# EAGLE schematic IrBB (EAGLE 6.3)
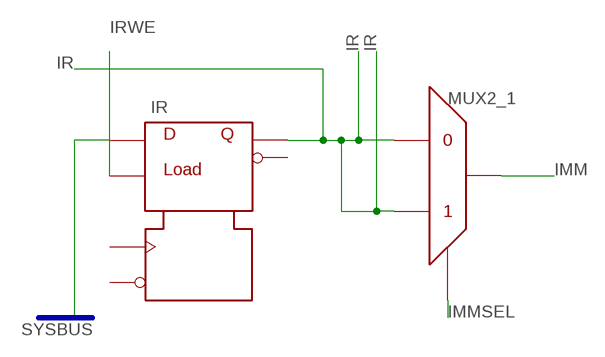
[diagram p0: schematic, sheet 1]

## Parts
IR  SCANREG  [6PIN]
MUX2_1  MUX2  [5PIN]

## Nets
IMM: MUX2_1.P$3
IMMSEL: MUX2_1.P$4
IR: IR.P$6(Q) MUX2_1.P$1 MUX2_1.P$2
IRWE: IR.P$3(LOAD)
N$2: IR.P$2(D)
Unconnected: IR.P$1(CLOCK) IR.P$4(NQ) IR.P$5(NRESET)

## Buses
SYSBUS

## Library data of the parts
IR = c035u:SCANREG
MUX2_1 = c035u:MUX2